# Altium schematic sheet IMU_Sch.SchDoc
size A3
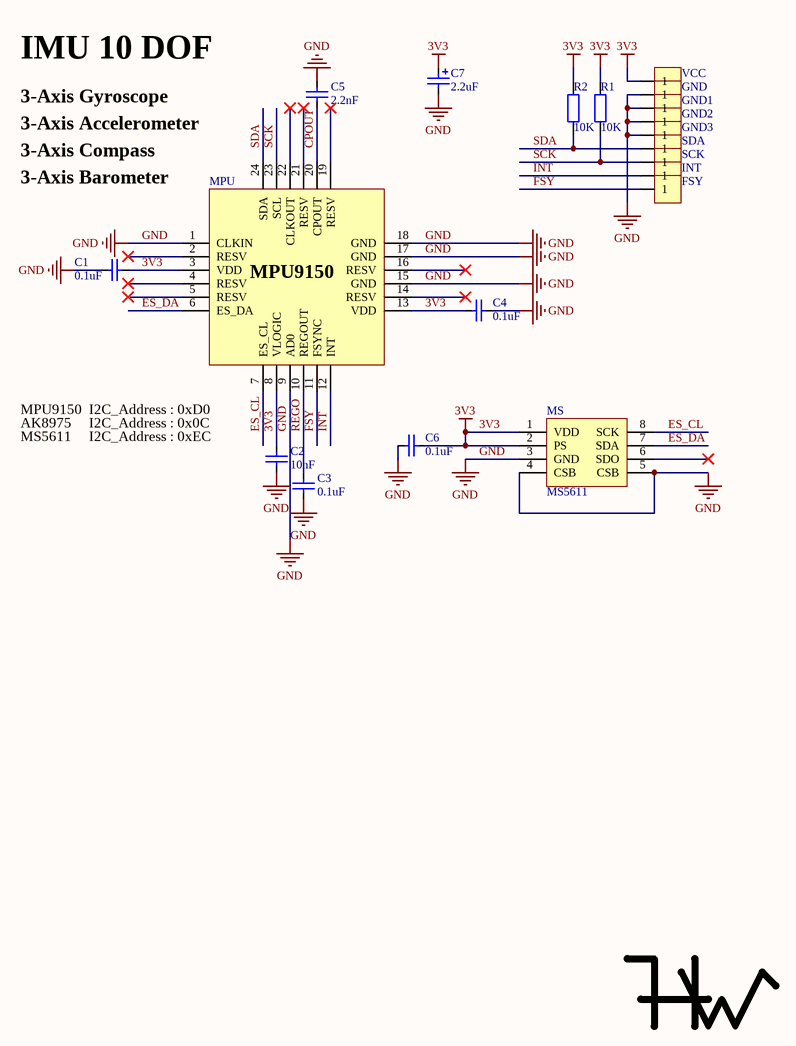
[diagram p0: IMU_Sch.SchDoc]

## Parts
C1  value 0.1uF  [CAP_0603]  (hidden comment: Cap_0603)
C2  value 10nF  [CAP_0603]  (hidden comment: Cap_0603)
C3  value 0.1uF  [CAP_0603]  (hidden comment: Cap_0603)
C4  value 0.1uF  [CAP_0603]  (hidden comment: Cap_0603)
C5  value 2.2nF  [CAP_0603]  (hidden comment: Cap_0603)
C6  value 0.1uF  [CAP_0603]  (hidden comment: Cap_0603)
C7  value 2.2uF  [CAP_TAN_P0805]  (hidden comment: Cap_Tan_0805)
FSY  Pad1X1_1.27  [Pad1X1_1.27]  (value not drawn)
GND  Pad1X1_1.27  [Pad1X1_1.27]  (value not drawn)
GND1  Pad1X1_1.27  [Pad1X1_1.27]  (value not drawn)
GND2  Pad1X1_1.27  [Pad1X1_1.27]  (value not drawn)
GND3  Pad1X1_1.27  [Pad1X1_1.27]  (value not drawn)
INT  Pad1X1_1.27  [Pad1X1_1.27]  (value not drawn)
Mark  Mark  [HW_Mark]  (value not drawn)
MPU  MPU9150  [MPU9150]
MS  MS5611  [MS5611]
R1  value 10K  [RES_0603]  (hidden comment: Res_0603)
R2  value 10K  [RES_0603]  (hidden comment: Res_0603)
SCK  Pad1X1_1.27  [Pad1X1_1.27]  (value not drawn)
SDA  Pad1X1_1.27  [Pad1X1_1.27]  (value not drawn)
VCC  Pad1X1_1.27  [Pad1X1_1.27]  (value not drawn)

## Nets
3V3: C1.2 C2.2 C4.2 C6.1 C7.1 MPU.3(VDD) MPU.8(VLOGIC) MPU.13(VDD) MS.1(VDD) MS.2(PS) R1.1 R2.1 VCC.1
GND: C1.1 C2.1 C3.1 C4.1 C5.2 C6.2 C7.2 GND.1 GND1.1 GND2.1 GND3.1 MPU.1(CLKIN) MPU.9(AD0) MPU.15(GND) MPU.17(GND) MPU.18(GND) MS.3(GND) MS.4(CSB) MS.5(CSB)
CPOUT: C5.1 MPU.20(CPOUT)
ES_CL: MPU.7(ES_CL) MS.8(SCK)
ES_DA: MPU.6(ES_DA) MS.7(SDA)
FSY: FSY.1 MPU.11(FSYNC)
INT: INT.1 MPU.12(INT)
REGO: C3.2 MPU.10(REGOUT)
SCK: MPU.23(SCL) R1.2 SCK.1
SDA: MPU.24(SDA) R2.2 SDA.1

Not connected (* = marked no-connect by the designer): MPU 2(RESV)* 4(RESV)* 5(RESV)* 14(RESV)* 16(RESV)* 19(RESV)* 21(RESV)* 22(CLKOUT)*; MS 6(SDO)*

## Notes on the sheet
- IMU 10 DOF
- 3-Axis Gyroscope
- 3-Axis Accelerometer
- 3-Axis Compass
- (near MPU) 3-Axis Barometer
- AK8975     I2C_Address : 0x0C
- (near MPU) MPU9150  I2C_Address : 0xD0
- MS5611     I2C_Address : 0xEC

## Library data of the parts
C1-C6 = Cap_0603: Capacitor
C7 = Cap_Tan_0805: Capacitor
FSY GND GND1-GND3 INT SCK SDA VCC = Pad1X1_1.27: Header
Mark = HW
MPU = MPU9150: Sensor
MS = MS5611: Sensor
R1 R2 = Res_0603: Resistor